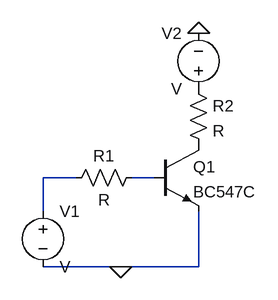
[diagram p0: schematic Draft1.asc]
Draft1.asc, the LTspice schematic file:
Version 4.1
SHEET 1 1344 680
WIRE 128 112 80 112
WIRE 240 112 208 112
WIRE 80 160 80 112
WIRE 192 240 80 240
WIRE 304 240 304 160
WIRE 304 240 192 240
FLAG 192 240 0
FLAG 304 -96 0
SYMBOL voltage 80 144 R0
SYMATTR InstName V1
SYMBOL voltage 304 0 R180
WINDOW 0 24 96 Left 2
WINDOW 3 24 16 Left 2
SYMATTR InstName V2
SYMBOL res 224 96 R90
WINDOW 0 0 56 VBottom 2
WINDOW 3 32 56 VTop 2
SYMATTR InstName R1
SYMBOL res 288 -32 R0
SYMATTR InstName R2
SYMBOL npn2 240 64 R0
SYMATTR InstName Q1
SYMATTR Value BC547C

The netlist it stands for:
* Draft1.asc
V1 N001 0 V
V2 P001 0 V
R1 N002 N001 R
R2 P001 P002 R
Q1 P002 N002 0 0 BC547C
.model NPN NPN
.model PNP PNP
.lib standard.bjt
.backanno
.end